# Altium schematic sheet GLCD.SchDoc: GLCD ILI9488
size A4; Engineer: Naif Aljohani; DocumentNumber: 2; Revision: V1.0; SheetNumber: 2; SheetTotal: 7
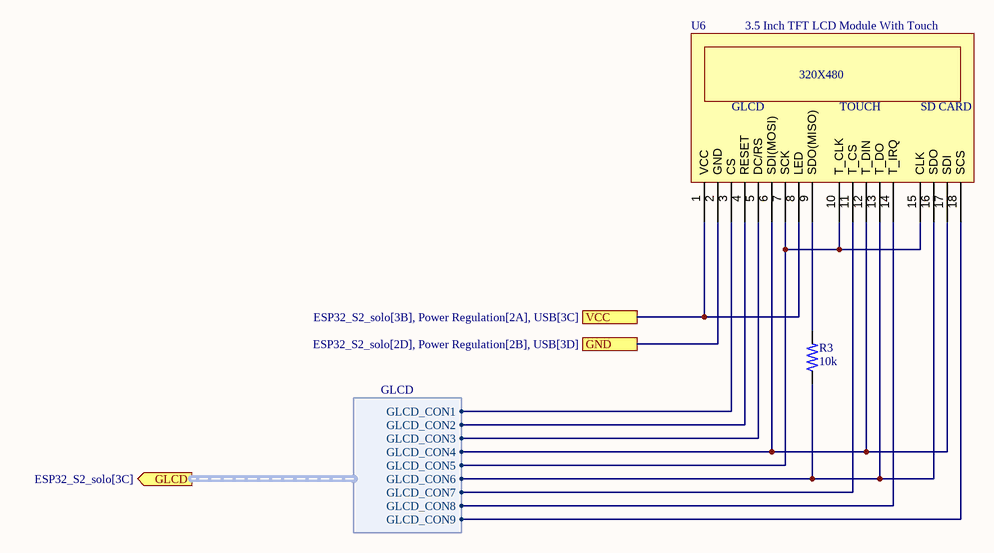
[diagram p0: GLCD.SchDoc]

## Parts
R3  10k  [RESC3115X65N]
U6  3.5 Inch TFT LCD Module With Touch  [PCBComponent_1]

## Ports
GLCD (out, harness GLCD, see ESP32_S2_solo[3C]), GND (see ESP32_S2_solo[2D], Power Regulation[2B], USB[3D]), VCC (see ESP32_S2_solo[3B], Power Regulation[2A], USB[3C])

## Harnesses
GLCD: GLCD_CON1, GLCD_CON2, GLCD_CON3, GLCD_CON4, GLCD_CON5, GLCD_CON6, GLCD_CON7, GLCD_CON8, GLCD_CON9

## Nets
GND: U6.2(GND) ; port GND
VCC: U6.1(VCC) U6.8(LED) ; port VCC
NetR3_1: R3.1 U6.13(T_DO) U6.16(SDO) ; port GLCD.GLCD_CON6
NetR3_2: R3.2 U6.9(SDO(MISO))
NetU6_3: U6.3(CS) ; port GLCD.GLCD_CON1
NetU6_4: U6.4(RESET) ; port GLCD.GLCD_CON2
NetU6_5: U6.5(DC/RS) ; port GLCD.GLCD_CON3
NetU6_6: U6.6(SDI(MOSI)) U6.12(T_DIN) U6.17(SDI) ; port GLCD.GLCD_CON4
NetU6_7: U6.7(SCK) U6.10(T_CLK) U6.15(CLK) ; port GLCD.GLCD_CON5
NetU6_11: U6.11(T_CS) ; port GLCD.GLCD_CON7
NetU6_14: U6.14(T_IRQ) ; port GLCD.GLCD_CON8
NetU6_18: U6.18(SCS) ; port GLCD.GLCD_CON9

## Notes on the sheet
- (in symbol ILI9488) 320X480; GLCD; TOUCH; SD CARD

## Library data of the parts
R3 = 1-1879462-4: RL73H 2B R43 1% 10 RL; MF: {'manufacturer': u'TE Connectivity'}; Package: None; Price: None; Value: *; MP: 1-1879462-4; Availability: Unavailable
U6 = ILI9488: ComponentLink1Description: New link; ComponentLink1URL: https://www.aliexpress.com/item/32954128438.html?spm=a2g0o.order_list.order_list_main.44.5fd61802HfjXd0